# Altium project DEMO_Project.PrjPcb
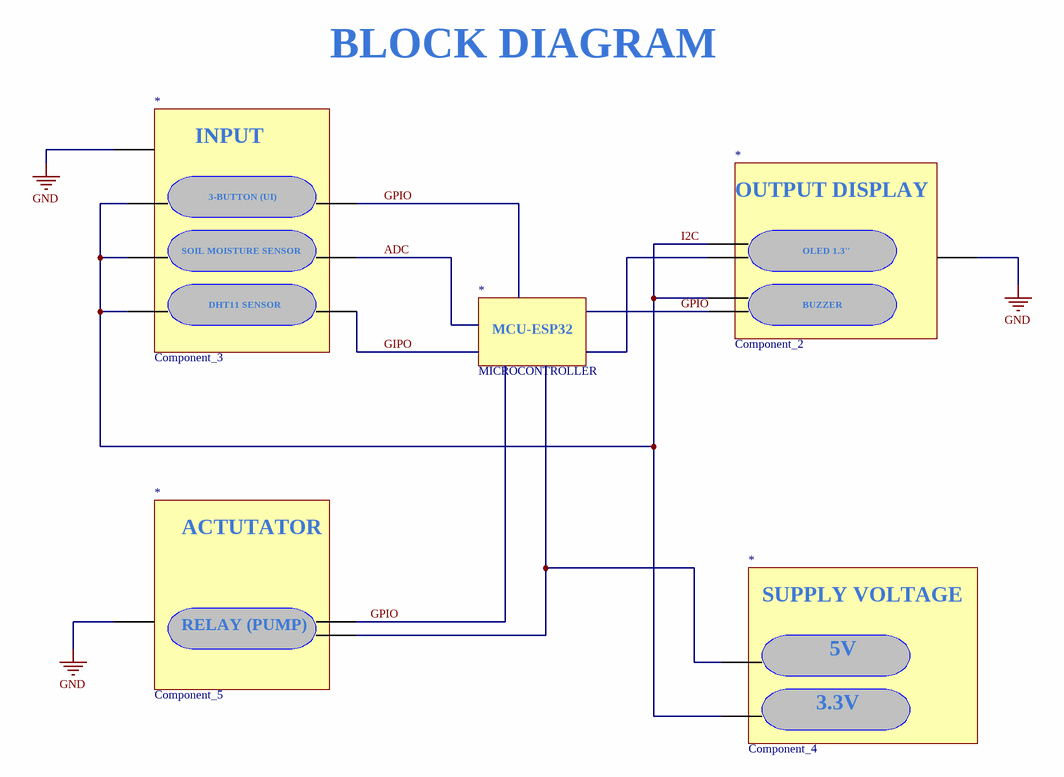
[diagram p0: BLOCKDIAGRAM.SchDoc]
2 sheets, 46 parts. Net scope: global (net labels, ports and power ports of the same name join across sheets).
Board file: pcb.pcbdoc
Sheets:
  BLOCKDIAGRAM.SchDoc
  sche_shield_esp32_5prj.schdoc

## Sheet BLOCKDIAGRAM.SchDoc: BLOCK DIAGRAM TRAM GIAM SAT NN
size A4; Author: PHAN SANG; SheetNumber: 2; SheetTotal: 2

### Parts
(Parts that share a designator on the sheet are numbered #1, #2 ... from top to bottom, then left to right.)
*#1  Component_3
*#2  Component_2
*#3  MICROCONTROLLER
*#4  Component_5
*#5  Component_4

### Nets
GND: *#1.99 *#2.101 *#4.101
ADC: *#1.104
GIPO: *#1.105
GPIO: *#1.103 *#2.101 *#4.100
I2C: *#1.100 *#1.101 *#1.102 *#2.101 *#5.101
Net*#4_101: *#4.101 *#5.100

Not connected (* = marked no-connect by the designer): *#2 100

### Notes on the sheet
- BLOCK DIAGRAM
- Title
- Size:
- Date:
- Author:
- A4
- Time:
- Number:
- MSSV:
- Revision:
- Sheet
- Approved:
- of
- File:
- (in symbol Component_1) MCU-ESP32
- (in symbol Component_2) OUTPUT DISPLAY; OLED 1.3''; BUZZER
- (in symbol Component_3) INPUT; 3-BUTTON (UI); SOIL MOISTURE SENSOR; DHT11 SENSOR
- (in symbol Component_4) SUPPLY VOLTAGE; 5V; 3.3V
- (in symbol Component_5) ACTUTATOR; RELAY (PUMP)

### Library data of the parts
*#3 = Component_1

## Sheet sche_shield_esp32_5prj.schdoc: IOT SMART FARM by using esp32
size A4; Date: 12/09/2025; CheckedBy: 2112182; Author: Phan Tấn Sang; SheetNumber: 2; SheetTotal: 1
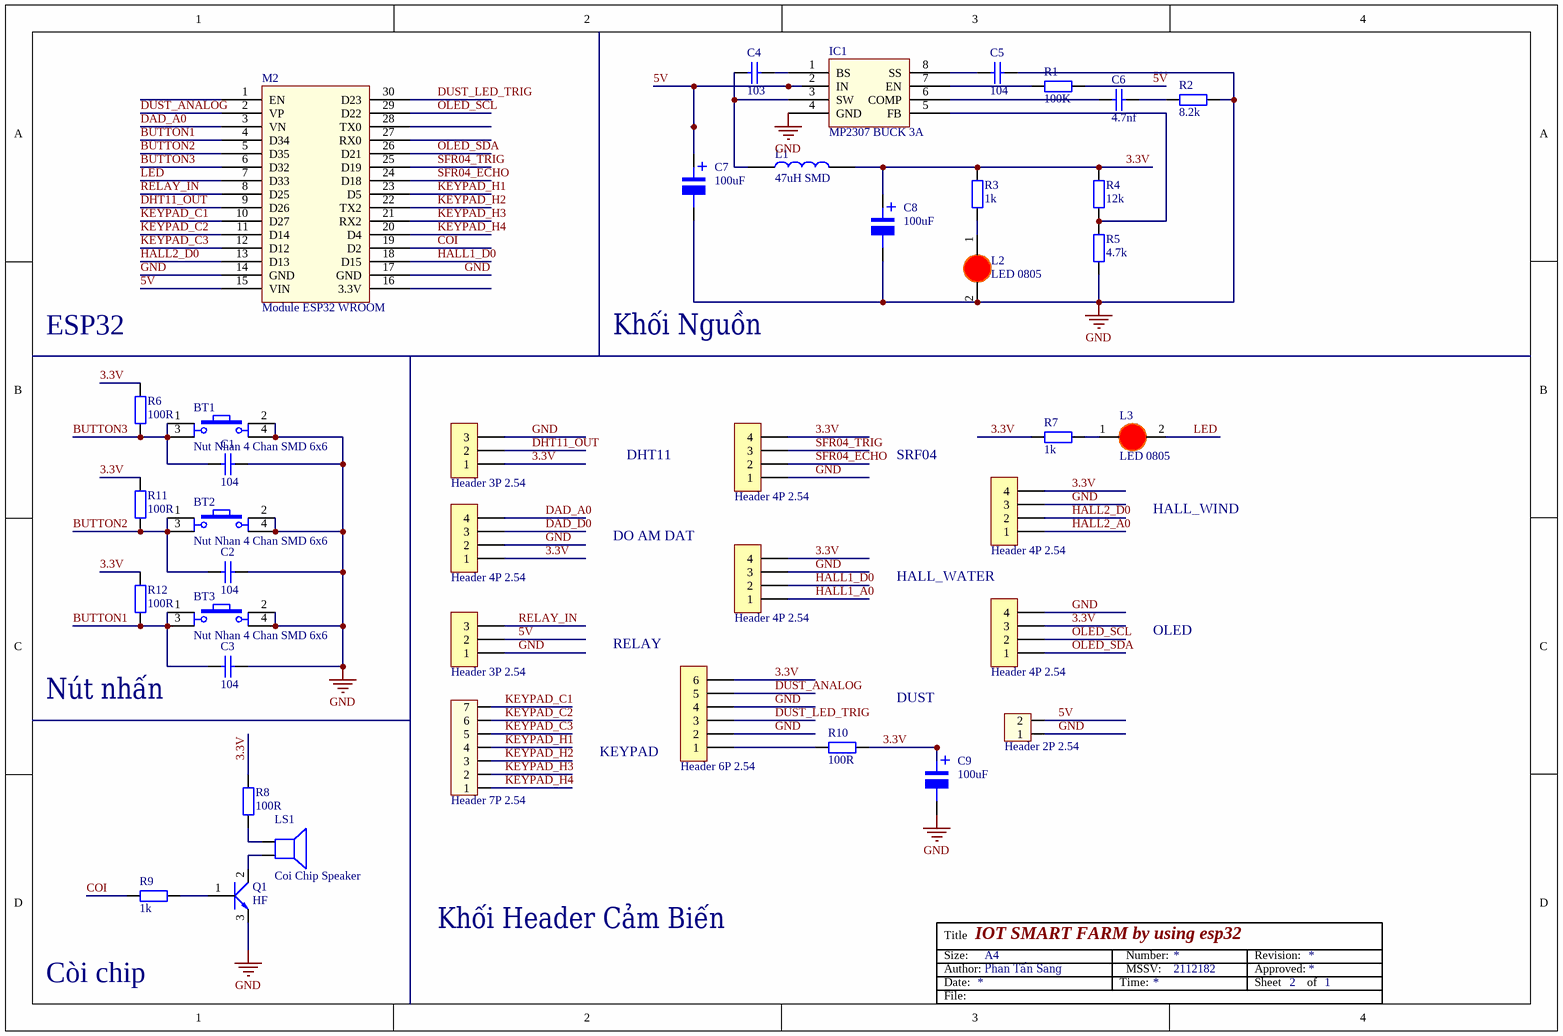
[diagram p1: sche_shield_esp32_5prj.schdoc]

### Parts
BT1  Nut Nhan 4 Chan SMD 6x6  [Nut Nhan 4 Chan SMD 6x6]
BT2  Nut Nhan 4 Chan SMD 6x6  [Nut Nhan 4 Chan SMD 6x6]
BT3  Nut Nhan 4 Chan SMD 6x6  [Nut Nhan 4 Chan SMD 6x6]
C1  104  [tu 0805]
C2  104  [tu 0805]
C3  104  [tu 0805]
C4  103  [Tro 0805]
C5  104  [Tro 0805]
C6  4.7nf  [Tro 0805]
C7  100uF  [tu nhom 6.3 (d)]
C8  100uF  [tu nhom 6.3 (d)]
C9  100uF  [tu nhom 6.3 (d)]
H1  Header 6P 2.54  [HEADER 6P 1.5]
H2  Header 4P 2.54  [XH2.54M-4]
H3  Header 3P 2.54  [XH2.54M-3]
H4  Header 4P 2.54  [XH2.54M-4]
H5  Header 4P 2.54  [XH2.54M-4]
H6  Header 3P 2.54  [XH2.54M-3]
H7  Header 4P 2.54  [XH2.54M-4]
H8  Header 7P 2.54  [XH2.54M-7]
H9  Header 4P 2.54  [XH2.54M-4]
H10  Header 2P 2.54  [Header 2P DC 2.54]
IC1  MP2307 BUCK 3A  [SOP8 2]
L1  47uH SMD  [Cuon Cam 6.5x6.5 SMD]
L2  LED 0805  [LED-0805-Red]
L3  LED 0805  [LED-0805-Red]
LS1  Coi Chip Speaker  [COI CHIP 9MM]
M2  Module ESP32 WROOM  [Module esp32 wroom]
Q1  HF  [SOT23]
R1  100K  [Tro 0805]
R2  8.2k  [Tro 0805]
R3  1k  [Tro 0805]
R4  12k  [Tro 0805]
R5  4.7k  [Tro 0805]
R6  100R  [Tro 0805]
R7  1k  [Tro 0805]
R8  100R  [Tro 0805]
R9  1k  [Tro 0805]
R10  100R  [Tro 0805]
R11  100R  [Tro 0805]
R12  100R  [Tro 0805]

### Nets
GND: BT1.2 BT1.4 BT2.2 BT2.4 BT3.2 BT3.4 C1.2 C2.2 C3.2 C5.1 C7.2 C8.2 C9.2 H1.2 H1.4 H2.1 H3.3 H4.3 H5.2 H6.1 H7.3 H9.4 H10.1 IC1.4(GND) L2.2(K) M2.14(GND) M2.17(GND) Q1.3(E) R2.1 R5.1
3.3V: C8.1 C9.1 H1.6 H2.4 H3.1 H4.4 H5.1 H7.4 H9.3 L1.2 R3.2 R4.2 R6.1 R7.2 R8.2 R10.1 R11.1 R12.1
5V: C7.1 H6.2 H10.2 IC1.2(IN) M2.15(VIN) R1.1
BUTTON1: BT3.1 BT3.3 C3.1 M2.4(D34) R12.2
BUTTON2: BT2.1 BT2.3 C2.1 M2.5(D35) R11.2
BUTTON3: BT1.1 BT1.3 C1.1 M2.6(D32) R6.2
COI: M2.19(D2) R9.2
DAD_A0: H5.4 M2.3(VN)
DAD_D0: H5.3
DHT11_OUT: H3.2 M2.9(D26)
DUST_ANALOG: H1.5 M2.2(VP)
DUST_LED_TRIG: H1.3 M2.30(D23)
HALL1_A0: H4.1
HALL1_D0: H4.2 M2.18(D15)
HALL2_A0: H7.1
HALL2_D0: H7.2 M2.13(D13)
KEYPAD_C1: H8.7 M2.10(D27)
KEYPAD_C2: H8.6 M2.11(D14)
KEYPAD_C3: H8.5 M2.12(D12)
KEYPAD_H1: H8.4 M2.23(D5)
KEYPAD_H2: H8.3 M2.22(TX2)
KEYPAD_H3: H8.2 M2.21(RX2)
KEYPAD_H4: H8.1 M2.20(D4)
LED: L3.2(K) M2.7(D33)
OLED_SCL: H9.2 M2.29(D22)
OLED_SDA: H9.1 M2.26(D21)
RELAY_IN: H6.3 M2.8(D25)
SFR04_ECHO: H2.2 M2.24(D18)
SFR04_TRIG: H2.3 M2.25(D19)
NetC4_1: C4.1 IC1.3(SW) L1.1
NetC4_2: C4.2 IC1.1(BS)
NetC5_2: C5.2 IC1.8(SS)
NetC6_1: C6.1 R2.2
NetC6_2: C6.2 IC1.6(COMP)
NetH1_1: H1.1 R10.2
NetIC1_5: IC1.5(FB) R4.1 R5.2
NetIC1_7: IC1.7(EN) R1.2
NetL2_1: L2.1(A) R3.1
NetL3_1: L3.1(A) R7.1
NetLS1_1: LS1.1 R8.1
NetLS1_2: LS1.2 Q1.2(C)
NetQ1_1: Q1.1(B) R9.1

Not connected (* = marked no-connect by the designer): M2 1(EN) 16(3.3V) 27(RX0) 28(TX0)

### Notes on the sheet
- ESP32
- Khối Nguồn
- DHT11
- SRF04
- HALL_WIND
- DO AM DAT
- HALL_WATER
- RELAY
- OLED
- Nút nhấn
- DUST
- KEYPAD
- Còi chip
- Khối Header Cảm Biến
- Title
- Size:
- Date:
- Author:
- A4
- Time:
- Number:
- MSSV:
- Revision:
- Sheet
- Approved:
- of
- File:
- (in symbol Tu Nhom 100uF 16V) +

### Library data of the parts
BT1-BT3 = Nut Nhan 4 Chan SMD 6x6: Nut Nhan 4 Chan 6.2x6.2x3.5; Ten: Nút Nhấn 4 Chân 6.2x6.2x3.1MM SMD; Ma_Hang: MH002424
C1-C3 = Tu 0805 104 50V 10%: Dán; Don_Vi: Con; So_Chan: 2; Ten_Linh_Kien: Tụ 0805 104-100nF 10% 50V; Ma_Hang: MH004551; Chung_Loai: Dán; Kieu_Chan: *
C4 = Tu 0603 103 50V 10%: Dán; Don_Vi: Con; So_Chan: 2; Ten_Linh_Kien: Tụ 0603 103-10nF 10% 50V; Ma_Hang: MH004567; Chung_Loai: Dán; Kieu_Chan: *
C5 C6 = Tu 0603 104 50V 10%: Dán; Don_Vi: Con; So_Chan: 2; Ten_Linh_Kien: Tụ 0603 104-100nF 10% 50V; Ma_Hang: MH004568; Chung_Loai: Dán; Kieu_Chan: *
C7-C9 = Tu Nhom 100uF 16V: Dán; Don_Vi: Con; So_Chan: 2; Ten_Linh_Kien: Tụ Nhôm 100uF 16V 6.3x5.4MM; Ma_Hang: MH002219; Chung_Loai: Dán; Kieu_Chan: *
H1 = Header 6P 2.54 Duc Thang: Cắm; Ten_Linh_Kien: Header 6P XH2.54-6P Đực Thẳng; Don_Vi: Con; Ma_Hang: MH001972; Chung_Loai: Cắm
H2 H4 H5 H7 H9 = Header 4P 2.54 Duc Thang: Cắm; Ten_Linh_Kien: Header 4P XH2.54-4P Đực Thẳng; Don_Vi: Con; Ma_Hang: MH001285; Chung_Loai: Cắm
H3 H6 = Header 3P 2.54 Duc Thang: Cắm; Ten_Linh_Kien: Header 3P XH2.54-3P Đực Thẳng; Don_Vi: Con; Ma_Hang: MH001292; Chung_Loai: Cắm
H8 = Header 7P 2.54 Duc Thang: Cắm; Ten_Linh_Kien: Header 7P XH2.54-7P Đực Thẳng; Don_Vi: Con; Ma_Hang: MH003369; Chung_Loai: Cắm
H10 = Header 2P 2.54 Duc Cong: Cắm; Ten_Linh_Kien: Header 2P XH2.54-2P Đực Cong; Don_Vi: Con; Ma_Hang: MH002852; Chung_Loai: Cắm
L1 = CUON CAM 47uH SMD: Dán; Don_Vi: Con; Ma_Hang: MH004211; Ten_Linh_Kien: Cuộn Cảm 47uH 7x7x4MM CD74R; Ghi_Chu: *; Kieu_Chan: *; Chung_Loai: Dán
L2 L3 = LED 0805 Do: Dán; Don_Vi: Con; Ma_Hang: MH000897; Ten_Linh_Kien: LED 0805 Màu Đỏ (Red); Ghi_Chu: *; Kieu_Chan: *; Chung_Loai: Dán
LS1 = Coi Chip Speaker: Còi chip
Q1 = C1815 HF SMD: NPN transistor; Value: C9014
R1-R5 R7 = Tro 0603 5% 10k: Dán; Don_Vi: Con; So_Chan: 2; Ten_Linh_Kien: Trở 0603 5% 10k; Ma_Hang: MH006316; Chung_Loai: Dán; Kieu_Chan: *
R6 R8-R12 = Tro 0805 5% 1k: Dán; Don_Vi: Con; So_Chan: 2; Ten_Linh_Kien: Trở 0805 5% 1k; Ma_Hang: MH005234; Chung_Loai: Dán; Kieu_Chan: *

## Nets that join several sheets
GND: BLOCKDIAGRAM (*#1.99 *#2.101 *#4.101), sche_shield_esp32_5prj (30 pins)